# EasyEDA Pro project ecg_frontend.epro

# Schematic Copy of Sheet1
Board Name: Copy of Sheet1; Create Date: 2025-10-21; Page Name: Copy of Sheet1; Project Name: ecg_frontend; Schematic Name: Copy of Sheet1; Update Date: 2025-10-22; Address1: *; Address2: *; Address3: *; Address4: *; Application_BuildNumber: *; ApprovedBy: *; Author: *; CheckedBy: *; CompanyName: *; CurrentDate: *; CurrentTime: *; Date: *; DocumentFullPathAndName: *; DocumentName: *; DocumentNumber: *; DrawnBy: *; Engineer: *; ImagePath: *; ModifiedDate: *; Organization: *; ProjectName: *; Revision: *; Rule: *; SheetNumber: 1; SheetTotal: 1; Time: *; Title: *
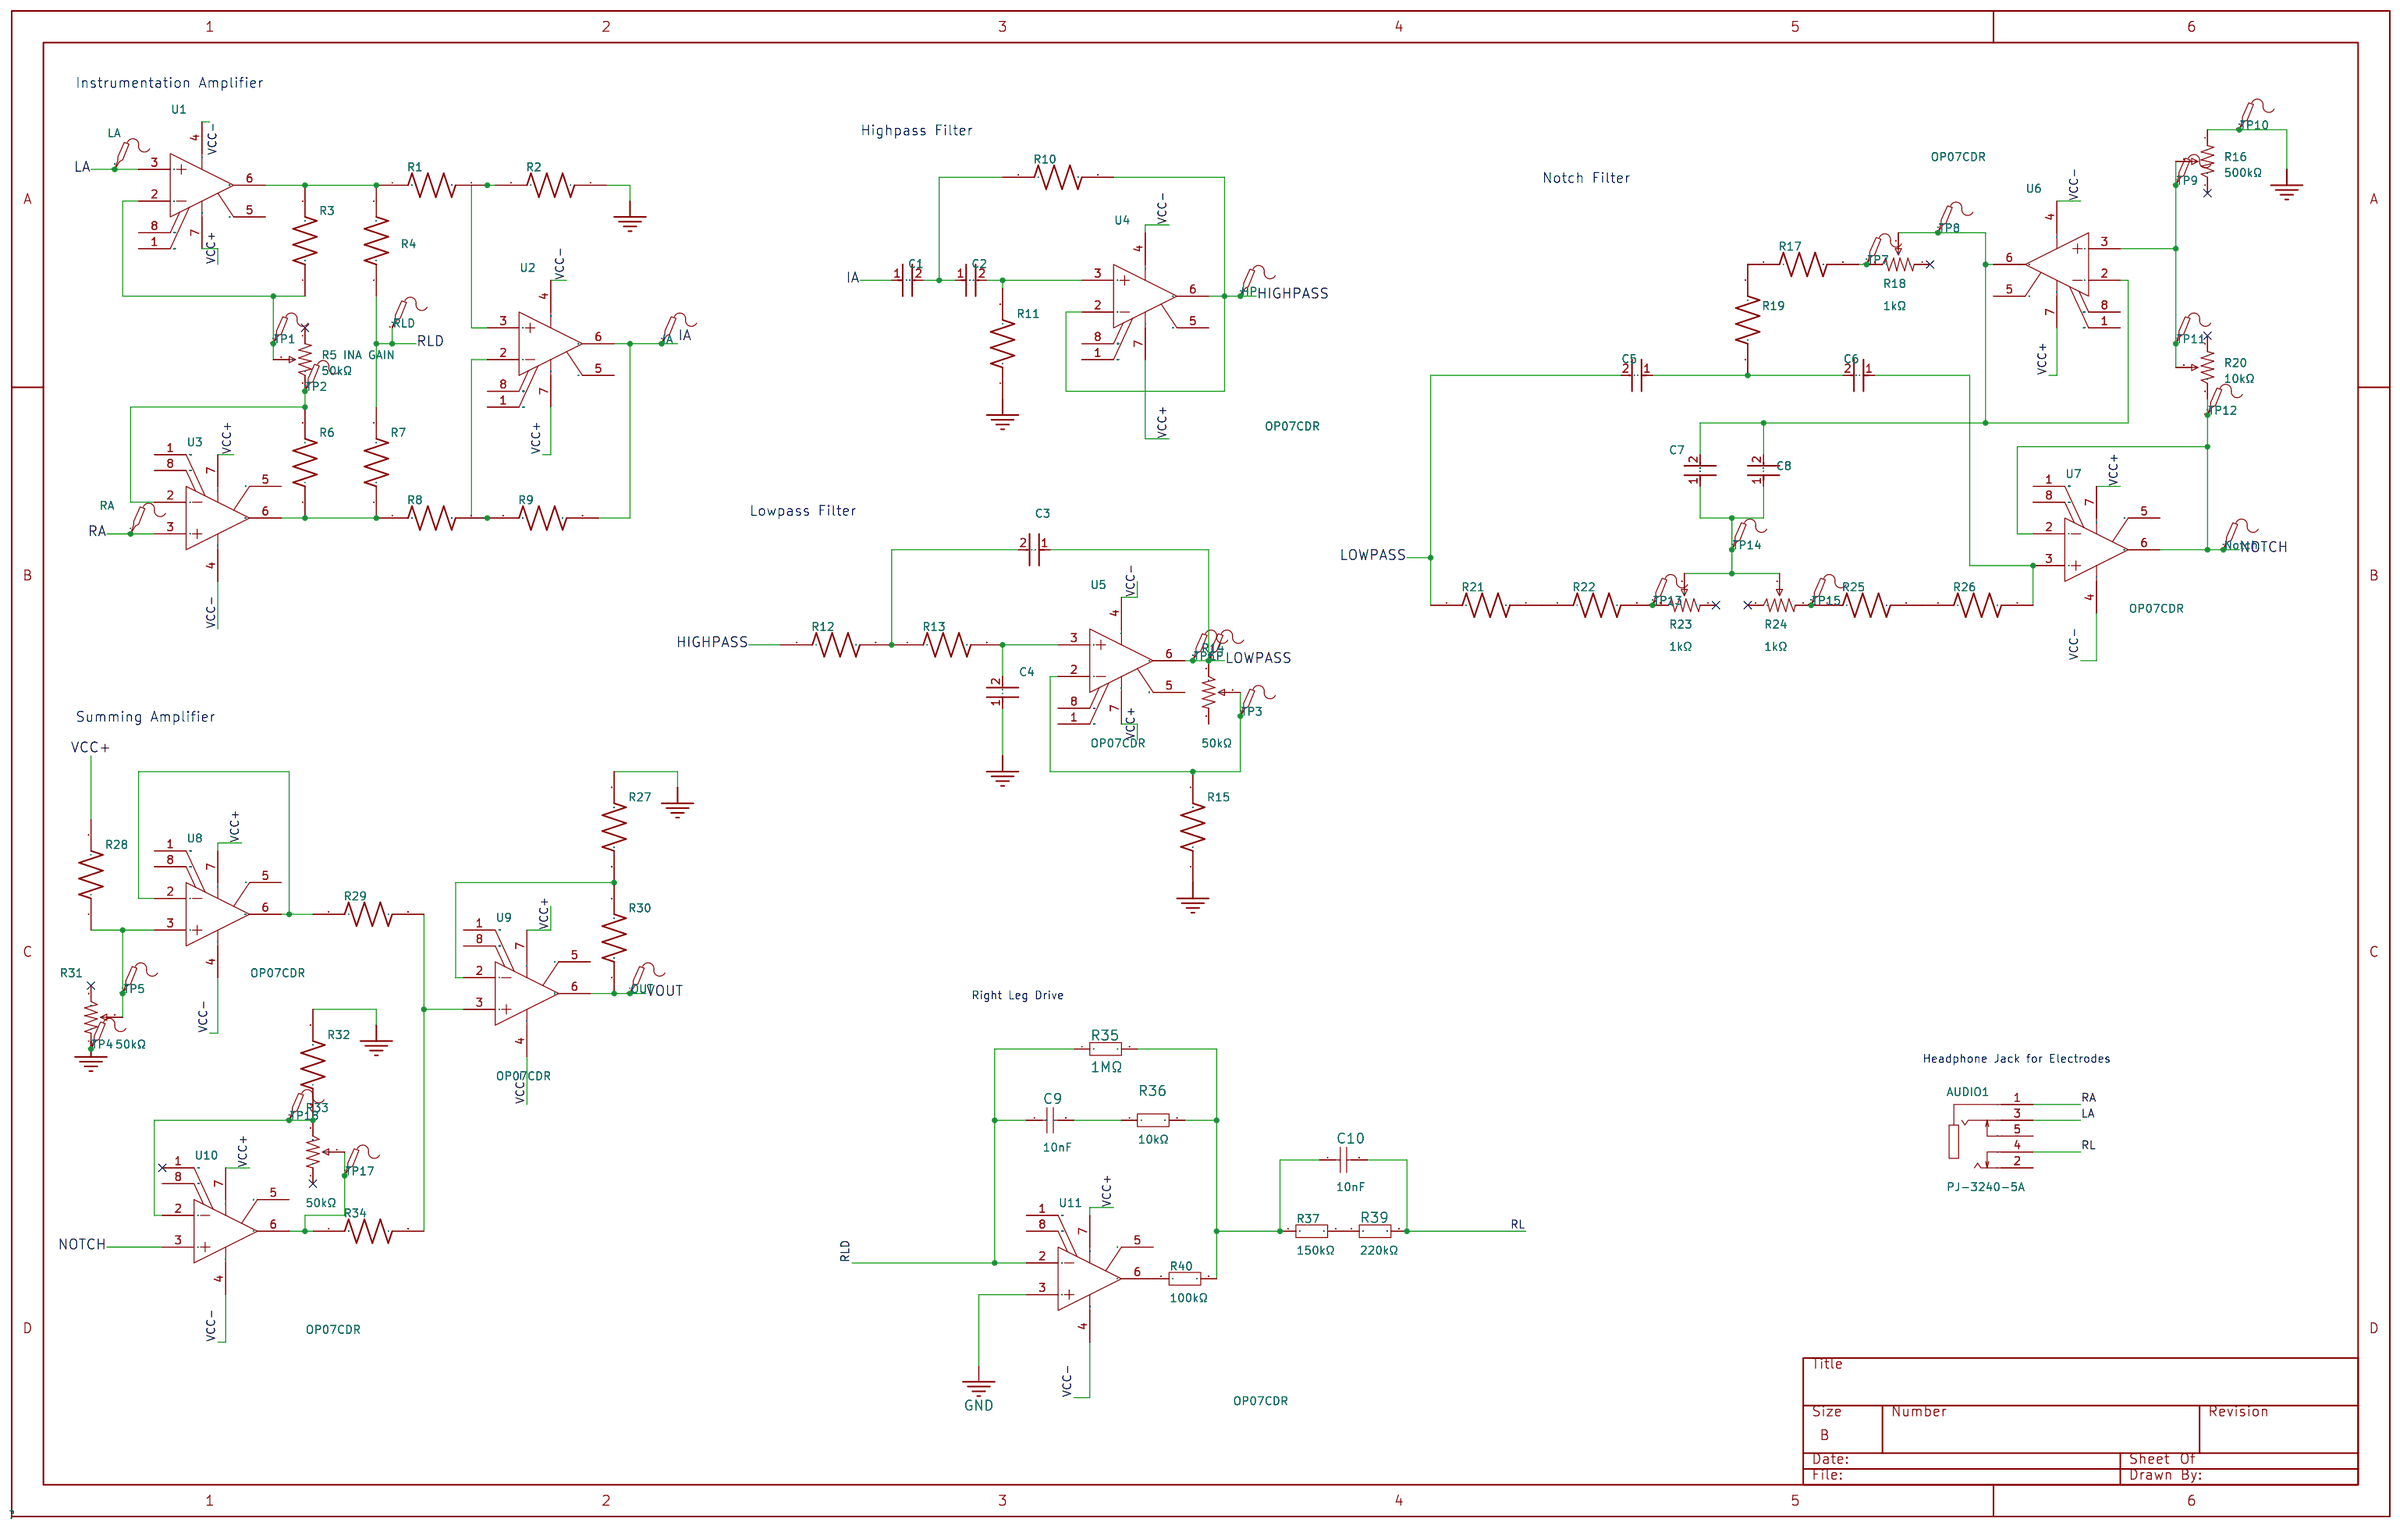
[diagram p0: schematic sheet]

## Parts
AUDIO1  PJ-3240-5A  [AUDIO-TH_PJ-3240-5A]
C1  100uF  [C1206]
C2  100uF  [C1206]
C3  100nF  [C0402]
C4  100nF  [C0402]
C5  100nF  [C0402]
C6  100nF  [C0402]
C7  100nF  [C0402]
C8  100nF  [C0402]
C9  10nF  [C0603]
C10  10nF  [C0603]
HP  -  [Test-Point-0.5mm]
IA  -  [Test-Point-0.5mm]
LA  -  [Test-Point-0.5mm]
LP  -  [Test-Point-0.5mm]
Notch  -  [Test-Point-0.5mm]
OUT  -  [Test-Point-0.5mm]
R1  10kΩ  [R0603]
R2  49.9kΩ  [R0603]
R3  100kΩ  [R0603]
R4  100kΩ  [R0603]
R5 INA GAIN  50kΩ  [RES-ADJ-TH_3P-L9.5-W4.85-P2.50-BL-BS]
R6  100kΩ  [R0603]
R7  100kΩ  [R0603]
R8  10kΩ  [R0603]
R9  49.9kΩ  [R0603]
R10  15kΩ  [R0603]
R11  33kΩ  [R0603]
R12  10kΩ  [R0603]
R13  10kΩ  [R0603]
R14  50kΩ  [RES-ADJ-TH_3P-L9.5-W4.85-P2.50-BL-BS]
R15  10kΩ  [R0603]
R16  500kΩ  [RES-ADJ-TH_3P-L9.5-W4.85-P2.50-BL-BS]
R17  680Ω  [R0603]
R18  1kΩ  [RES-ADJ-TH_3296W-1-203]
R19  15kΩ  [R0603]
R20  10kΩ  [RES-ADJ-TH_3296W]
R21  30kΩ  [R0603]
R22  1.5kΩ  [R0603]
R23  1kΩ  [RES-ADJ-TH_3296W-1-203]
R24  1kΩ  [RES-ADJ-TH_3296W-1-203]
R25  30kΩ  [R0603]
R26  1.5kΩ  [R0603]
R27  10kΩ  [R0603]
R28  10kΩ  [R0603]
R29  10kΩ  [R0603]
R30  10kΩ  [R0603]
R31  50kΩ  [RES-ADJ-TH_3P-L9.5-W4.85-P2.50-BL-BS]
R32  10kΩ  [R0603]
R33  50kΩ  [RES-ADJ-TH_3P-L9.5-W4.85-P2.50-BL-BS]
R34  10kΩ  [R0603]
R35  1MΩ  [R0603]
R36  10kΩ  [R0603]
R37  150kΩ  [R0603]
R39  220kΩ  [R0603]
R40  100kΩ  [R0603]
RA  -  [Test-Point-0.5mm]
RLD  -  [Test-Point-0.5mm]
TP1  -  [Test-Point-0.5mm]
TP2  -  [Test-Point-0.5mm]
TP3  -  [Test-Point-0.5mm]
TP4  -  [Test-Point-0.5mm]
TP5  -  [Test-Point-0.5mm]
TP6  -  [Test-Point-0.5mm]
TP7  -  [Test-Point-0.5mm]
TP8  -  [Test-Point-0.5mm]
TP9  -  [Test-Point-0.5mm]
TP10  -  [Test-Point-0.5mm]
TP11  -  [Test-Point-0.5mm]
TP12  -  [Test-Point-0.5mm]
TP13  -  [Test-Point-0.5mm]
TP14  -  [Test-Point-0.5mm]
TP15  -  [Test-Point-0.5mm]
TP17  -  [Test-Point-0.5mm]
TP18  -  [Test-Point-0.5mm]
U1  OP07CDR  [SOIC-8_L4.9-W3.9-P1.27-LS6.0-BL]
U2  OP07CDR  [SOIC-8_L4.9-W3.9-P1.27-LS6.0-BL]
U3  OP07CDR  [SOIC-8_L4.9-W3.9-P1.27-LS6.0-BL]
U4  OP07CDR  [SOIC-8_L4.9-W3.9-P1.27-LS6.0-BL]
U5  OP07CDR  [SOIC-8_L4.9-W3.9-P1.27-LS6.0-BL]
U6  OP07CDR  [SOIC-8_L4.9-W3.9-P1.27-LS6.0-BL]
U7  OP07CDR  [SOIC-8_L4.9-W3.9-P1.27-LS6.0-BL]
U8  OP07CDR  [SOIC-8_L4.9-W3.9-P1.27-LS6.0-BL]
U9  OP07CDR  [SOIC-8_L4.9-W3.9-P1.27-LS6.0-BL]
U10  OP07CDR  [SOIC-8_L4.9-W3.9-P1.27-LS6.0-BL]
U11  OP07CDR  [SOIC-8_L4.9-W3.9-P1.27-LS6.0-BL]

## Library data of the parts
AUDIO1 = PJ-3240-5A: Connector Type:3.5mm Headphone Jack Current Rating:500mA Voltage Rating (Max):30V; LCSC Part Name: 3.5mm耳机座; Supplier Part: C145814; Manufacturer: 韩国韩荣; Supplier Footprint: 插件; JLCPCB Part Class: Extended Part; Datasheet: https://item.szlcsc.com/datasheet/PJ-3240-5A/157146.html; Supplier: LCSC; Connector Type: 3.5mm Headphone Jack; Current Rating: 500mA; Voltage Rating (Max): 30V
C1 C2 = CL31A107MQHNNNE: Capacitance:100uF Tolerance:±20% Tolerance:±20% Voltage Rating:6.3V Temperature Coefficient:X5R; LCSC Part Name: 100uF ±20% 6.3V; Supplier Part: C15008; Manufacturer: SAMSUNG(三星); Supplier Footprint: 1206; JLCPCB Part Class: Basic Part; Datasheet: https://item.szlcsc.com/datasheet/CL31A107MQHNNNE/15681.html; Supplier: LCSC; Tolerance: ±20%; Voltage Rating: 6.3V; Temperature Coefficient: X5R
C3-C8 = CL05B104KO5NNNC: Capacitance:100nF Tolerance:±10% Tolerance:±10% Voltage Rating:16V Temperature Coefficient:X7R; LCSC Part Name: 100nF ±10% 16V; Supplier Part: C1525; Manufacturer: SAMSUNG(三星); Supplier Footprint: 0402; JLCPCB Part Class: Basic Part; Datasheet: https://item.szlcsc.com/datasheet/CL05B104KO5NNNC/1877.html; Supplier: LCSC; Tolerance: ±10%; Voltage Rating: 16V; Temperature Coefficient: X7R
C9 C10 = 0603B103K500NT: Capacitance:10nF Tolerance:±10% Tolerance:±10% Voltage Rating:50V Temperature Coefficient:X7R; LCSC Part Name: 10nF ±10% 50V; Supplier Part: C57112; Manufacturer: FH(风华); Supplier Footprint: 0603; JLCPCB Part Class: Basic Part; Datasheet: https://item.szlcsc.com/datasheet/0603B103K500NT/58143.html; Supplier: LCSC; Tolerance: ±10%; Voltage Rating: 50V; Temperature Coefficient: X7R
HP IA LA LP Notch OUT RA RLD TP1-TP15 TP17 TP18 = Test-Point: Test Point 测试点
R1 R8 R12 R13 R15 R27-R30 R32 R34 R36 = 0603WAF1002T5E: Type:Thick Film Resistor Resistance:10kΩ Tolerance:±1% Tolerance:±1% Power(Watts):100mW Voltage-Supply(Max):75V Temperature Coefficient:±100ppm/℃ Temperature Coefficient:±100ppm/℃ Operating Temperature:-55℃~+155℃ Operating Temperature:-55℃~+155℃; LCSC Part Name: 厚膜电阻 10kΩ ±1% 100mW; Supplier Part: C25804; Manufacturer: UNI-ROYAL(厚声); Supplier Footprint: 0603; JLCPCB Part Class: Basic Part; Datasheet: https://item.szlcsc.com/datasheet/0603WAF1002T5E/26547.html; Supplier: LCSC; Type: Thick Film Resistor; Tolerance: ±1%; Power(Watts): 100mW; Voltage-Supply(Max): 75V; Temperature Coefficient: ±100ppm/℃; Operating Temperature: -55℃~+155℃
R2 R9 = 0603WAF4992T5E: Type:Thick Film Resistor Resistance:49.9kΩ Tolerance:±1% Tolerance:±1% Power(Watts):100mW Voltage-Supply(Max):75V Temperature Coefficient:±100ppm/℃ Temperature Coefficient:±100ppm/℃ Operating Temperature:-55℃~+155℃ Operating Temperature:-55℃~+155℃; LCSC Part Name: 49.9kΩ ±1% 100mW 厚膜电阻; Supplier Part: C23184; Manufacturer: UNI-ROYAL(厚声); Supplier Footprint: 0603; JLCPCB Part Class: Basic Part; Datasheet: https://item.szlcsc.com/datasheet/0603WAF4992T5E/23911.html; Supplier: LCSC; Type: Thick Film Resistor; Tolerance: ±1%; Power(Watts): 100mW; Voltage-Supply(Max): 75V; Temperature Coefficient: ±100ppm/℃; Operating Temperature: -55℃~+155℃
R3 R4 R6 R7 R40 = 0603WAF1003T5E: Type:Thick Film Resistor Resistance:100kΩ Tolerance:±1% Tolerance:±1% Power(Watts):100mW Voltage-Supply(Max):75V Temperature Coefficient:±100ppm/℃ Temperature Coefficient:±100ppm/℃ Operating Temperature:-55℃~+155℃ Operating Temperature:-55℃~+155℃; LCSC Part Name: 100kΩ ±1% 100mW 厚膜电阻; Supplier Part: C25803; Manufacturer: UNI-ROYAL(厚声); Supplier Footprint: 0603; JLCPCB Part Class: Basic Part; Datasheet: https://item.szlcsc.com/datasheet/0603WAF1003T5E/26546.html; Supplier: LCSC; Type: Thick Film Resistor; Tolerance: ±1%; Power(Watts): 100mW; Voltage-Supply(Max): 75V; Temperature Coefficient: ±100ppm/℃; Operating Temperature: -55℃~+155℃
R5 INA GAIN R14 R31 R33 = 3296W-1-503_C48997928: Resistance:50kΩ Tolerance:±10% Tolerance:±10% Power(Watts):500mW Temperature Coefficient:±250ppm/℃ Temperature Coefficient:±250ppm/℃ Number of Turns:28; LCSC Part Name: 3296W-1-503; Supplier Part: C48997928; Manufacturer: JIERR(捷而瑞); Manufacturer Part: 3296W-1-503; Supplier Footprint: 插件-3P,9.5x4.9mm; JLCPCB Part Class: Extended Part; Datasheet: https://item.szlcsc.com/datasheet/3296W-1-503/51342064.html; Supplier: LCSC; Tolerance: ±10%; Power(Watts): 500mW; Temperature Coefficient: ±250ppm/℃; Number of Turns: 28
R10 R19 = 0603WAF1502T5E: Type:Thick Film Resistor Resistance:15kΩ Tolerance:±1% Tolerance:±1% Power(Watts):100mW Voltage-Supply(Max):75V Temperature Coefficient:±100ppm/℃ Temperature Coefficient:±100ppm/℃ Operating Temperature:-55℃~+155℃ Operating Temperature:-55℃~+155℃; LCSC Part Name: 15kΩ ±1% 100mW 厚膜电阻; Supplier Part: C22809; Manufacturer: UNI-ROYAL(厚声); Supplier Footprint: 0603; JLCPCB Part Class: Basic Part; Datasheet: https://item.szlcsc.com/datasheet/0603WAF1502T5E/23536.html; Supplier: LCSC; Type: Thick Film Resistor; Tolerance: ±1%; Power(Watts): 100mW; Voltage-Supply(Max): 75V; Temperature Coefficient: ±100ppm/℃; Operating Temperature: -55℃~+155℃
R11 = 0603WAF3302T5E: Type:Thick Film Resistor Resistance:33kΩ Tolerance:±1% Tolerance:±1% Power(Watts):100mW Voltage-Supply(Max):75V Temperature Coefficient:±100ppm/℃ Temperature Coefficient:±100ppm/℃ Operating Temperature:-55℃~+155℃ Operating Temperature:-55℃~+155℃; LCSC Part Name: 33kΩ ±1% 100mW 厚膜电阻; Supplier Part: C4216; Manufacturer: UNI-ROYAL(厚声); Supplier Footprint: 0603; JLCPCB Part Class: Basic Part; Datasheet: https://item.szlcsc.com/datasheet/0603WAF3302T5E/4623.html; Supplier: LCSC; Type: Thick Film Resistor; Tolerance: ±1%; Power(Watts): 100mW; Voltage-Supply(Max): 75V; Temperature Coefficient: ±100ppm/℃; Operating Temperature: -55℃~+155℃
R16 = 3296W-1-504_C48997927: Resistance:500kΩ Tolerance:±10% Tolerance:±10% Power(Watts):500mW Temperature Coefficient:±250ppm/℃ Temperature Coefficient:±250ppm/℃ Number of Turns:28; LCSC Part Name: 3296W-1-504; Supplier Part: C48997927; Manufacturer: JIERR(捷而瑞); Manufacturer Part: 3296W-1-504; Supplier Footprint: 插件-3P,9.5x4.9mm; JLCPCB Part Class: Extended Part; Datasheet: https://item.szlcsc.com/datasheet/3296W-1-504/51342063.html; Supplier: LCSC; Tolerance: ±10%; Power(Watts): 500mW; Temperature Coefficient: ±250ppm/℃; Number of Turns: 28
R17 = 0603WAF6800T5E: Type:Thick Film Resistors Resistance: Tolerance:±1% Tolerance:±1% Power(Watts): Overload Voltage (Max): Temperature Coefficient:±100ppm/℃ Temperature Coefficient:±100ppm/℃ Operating Temperature Range:-55℃~+155℃ Operating Temperature Range:-55℃~+155℃; LCSC Part Name: 680Ω ±1% 100mW 厚膜电阻; Supplier Part: C23228; Manufacturer: UNI-ROYAL(厚声); Supplier Footprint: 0603; JLCPCB Part Class: Basic Part; Datasheet: https://atta.szlcsc.com/upload/public/pdf/source/20200306/C422600_1E6D84923E4A46A82E41ADD87F860B5C.pdf; Supplier: LCSC; Type: Thick Film Resistors; Tolerance: ±1%; Temperature Coefficient: ±100ppm/℃; Operating Temperature Range: -55℃~+155℃
R18 R23 R24 = 3296W-1-102_C48997938: Resistance:1kΩ Tolerance:±10% Tolerance:±10% Power(Watts):500mW Temperature Coefficient:±250ppm/℃ Temperature Coefficient:±250ppm/℃ Number of Turns:28; LCSC Part Name: 3296W-1-102; Supplier Part: C48997938; Manufacturer: JIERR(捷而瑞); Manufacturer Part: 3296W-1-102; Supplier Footprint: 插件-3P,9.5x4.9mm; JLCPCB Part Class: Extended Part; Datasheet: https://item.szlcsc.com/datasheet/3296W-1-102/51342074.html; Supplier: LCSC; Tolerance: ±10%; Power(Watts): 500mW; Temperature Coefficient: ±250ppm/℃; Number of Turns: 28
R20 = 3296W-1-103_C48997937: Resistance:10kΩ Tolerance:±10% Tolerance:±10% Power(Watts):500mW Temperature Coefficient:±250ppm/℃ Temperature Coefficient:±250ppm/℃ Number of Turns:28; LCSC Part Name: 3296W-1-103; Supplier Part: C48997937; Manufacturer: JIERR(捷而瑞); Manufacturer Part: 3296W-1-103; Supplier Footprint: 插件-3P,9.5x4.9mm; JLCPCB Part Class: Extended Part; Datasheet: https://item.szlcsc.com/datasheet/3296W-1-103/51342073.html; Supplier: LCSC; Tolerance: ±10%; Power(Watts): 500mW; Temperature Coefficient: ±250ppm/℃; Number of Turns: 28
R21 R25 = 0603WAF3002T5E: Type:Thick Film Resistor Resistance:30kΩ Tolerance:±1% Tolerance:±1% Power(Watts):100mW Voltage-Supply(Max):75V Temperature Coefficient:±100ppm/℃ Temperature Coefficient:±100ppm/℃ Operating Temperature:-55℃~+155℃ Operating Temperature:-55℃~+155℃; LCSC Part Name: 30kΩ ±1% 100mW 厚膜电阻; Supplier Part: C22984; Manufacturer: UNI-ROYAL(厚声); Supplier Footprint: 0603; JLCPCB Part Class: Basic Part; Datasheet: https://item.szlcsc.com/datasheet/0603WAF3002T5E/23711.html; Supplier: LCSC; Type: Thick Film Resistor; Tolerance: ±1%; Power(Watts): 100mW; Voltage-Supply(Max): 75V; Temperature Coefficient: ±100ppm/℃; Operating Temperature: -55℃~+155℃
R22 R26 = 0603WAF1501T5E: Type:Thick Film Resistor Resistance:1.5kΩ Tolerance:±1% Tolerance:±1% Power(Watts):100mW Voltage-Supply(Max):75V Temperature Coefficient:±100ppm/℃ Temperature Coefficient:±100ppm/℃ Operating Temperature:-55℃~+155℃ Operating Temperature:-55℃~+155℃; LCSC Part Name: 1.5kΩ ±1% 100mW 厚膜电阻; Supplier Part: C22843; Manufacturer: UNI-ROYAL(厚声); Supplier Footprint: 0603; JLCPCB Part Class: Basic Part; Datasheet: https://item.szlcsc.com/datasheet/0603WAF1501T5E/23570.html; Supplier: LCSC; Type: Thick Film Resistor; Tolerance: ±1%; Power(Watts): 100mW; Voltage-Supply(Max): 75V; Temperature Coefficient: ±100ppm/℃; Operating Temperature: -55℃~+155℃
R35 = 0603WAF1004T5E: Type:Thick Film Resistors Resistance:1MΩ Tolerance:±1% Tolerance:±1% Power(Watts): Overload Voltage (Max): Temperature Coefficient:±100ppm/℃ Temperature Coefficient:±100ppm/℃ Operating Temperature Range:-55℃~+155℃ Operating Temperature Range:-55℃~+155℃; LCSC Part Name: 1MΩ ±1% 100mW 厚膜电阻; Supplier Part: C22935; Manufacturer: UNI-ROYAL(厚声); Supplier Footprint: 0603; JLCPCB Part Class: Basic Part; Datasheet: https://atta.szlcsc.com/upload/public/pdf/source/20200306/C422600_1E6D84923E4A46A82E41ADD87F860B5C.pdf; Supplier: LCSC; Type: Thick Film Resistors; Tolerance: ±1%; Temperature Coefficient: ±100ppm/℃; Operating Temperature Range: -55℃~+155℃
R37 = 0603WAF1503T5E: Type:Thick Film Resistors Resistance:150kΩ Tolerance:±1% Tolerance:±1% Power(Watts):0.1W Voltage-Supply(Max):75V Temperature Coefficient:±100ppm/℃ Temperature Coefficient:±100ppm/℃ Operating Temperature:-55℃~+155℃ Operating Temperature:-55℃~+155℃; LCSC Part Name: 150kΩ ±1% 100mW 厚膜电阻; Supplier Part: C22807; Manufacturer: UNI-ROYAL(厚声); Supplier Footprint: 0603; JLCPCB Part Class: Basic Part; Datasheet: https://item.szlcsc.com/datasheet/0603WAF1503T5E/23534.html; Supplier: LCSC; Type: Thick Film Resistors; Tolerance: ±1%; Power(Watts): 0.1W; Voltage-Supply(Max): 75V; Temperature Coefficient: ±100ppm/℃; Operating Temperature: -55℃~+155℃
R39 = 0603WAF2203T5E: Type:Thick Film Resistor Resistance:220kΩ Tolerance:±1% Tolerance:±1% Power(Watts):100mW Voltage-Supply(Max):75V Temperature Coefficient:±100ppm/℃ Temperature Coefficient:±100ppm/℃ Operating Temperature:-55℃~+155℃ Operating Temperature:-55℃~+155℃; LCSC Part Name: 220kΩ ±1% 100mW 厚膜电阻; Supplier Part: C22961; Manufacturer: UNI-ROYAL(厚声); Supplier Footprint: 0603; JLCPCB Part Class: Basic Part; Datasheet: https://item.szlcsc.com/datasheet/0603WAF2203T5E/23688.html; Supplier: LCSC; Type: Thick Film Resistor; Tolerance: ±1%; Power(Watts): 100mW; Voltage-Supply(Max): 75V; Temperature Coefficient: ±100ppm/℃; Operating Temperature: -55℃~+155℃
U1-U11 = OP07CDR: Number of Channels:Single channel Gain Bandwidth Product:600kHz Ib - Input Bias Current:1.8nA Slew Rate:0.3V/us Output Type:- Rail to Rail:- Operating Temperature:0℃~+70℃ Operating Temperature:0℃~+70℃; LCSC Part Name: 精密运算放大器; Supplier Part: C7433; Manufacturer: TI(德州仪器); Supplier Footprint: SOIC-8; JLCPCB Part Class: Basic Part; Datasheet: http://www.ti.com/cn/lit/gpn/op07c; Supplier: LCSC; Number of Channels: Single channel; Gain Bandwidth Product: 600kHz; Ib - Input Bias Current: 1.8nA; Slew Rate: 0.3V/us; Operating Temperature: 0℃~+70℃

## Nets
GND: C4.1 R2.2 R11.1 R15.1 R16.1 R27.2 R31.1 R32.2 TP4.1 TP10.1 U11.3(IN+)
VCC+: R28.2 U1.7(VCC+) U2.7(VCC+) U3.7(VCC+) U4.7(VCC+) U5.7(VCC+) U6.7(VCC+) U7.7(VCC+) U8.7(VCC+) U9.7(VCC+) U10.7(VCC+) U11.7(VCC+)
VCC-: U1.4(VCC-) U2.4(VCC-) U3.4(VCC-) U4.4(VCC-) U5.4(VCC-) U6.4(VCC-) U7.4(VCC-) U8.4(VCC-) U9.4(VCC-) U10.4(VCC-) U11.4(VCC-)
HIGHPASS: HP.1 R10.2 R12.1 U4.2(IN-) U4.6(OUT)
IA: C1.1 IA.1 R9.2 U2.6(OUT)
LA: AUDIO1.3 LA.1 U1.3(IN+)
LOWPASS: C3.1 C5.2 LP.1 R14.3 R21.1 TP6.1 U5.6(OUT)
NOTCH: Notch.1 R20.3 TP12.1 U7.2(IN-) U7.6(OUT) U10.3(IN+)
RA: AUDIO1.1 RA.1 U3.3(IN+)
RL: AUDIO1.4 C10.2 R39.2
RLD: C9.1 R4.1 R7.2 R35.1 RLD.1 U11.2(IN-)
VOUT: OUT.1 R30.1 U9.6(OUT)
Net-(C1-2): C1.2 C2.1 R10.1
Net-(C2-2): C2.2 R11.2 U4.3(IN+)
Net-(C3-2): C3.2 R12.2 R13.1
Net-(C4-2): C4.2 R13.2 U5.3(IN+)
Net-(C5-1): C5.1 C6.2 R19.1
Net-(C6-1): C6.1 R26.2 U7.3(IN+)
Net-(C7-1): C7.1 C8.1 R23.2 R24.2 TP14.1
Net-(C7-2): C7.2 C8.2 R18.2 TP8.1 U6.2(IN-) U6.6(OUT)
Net-(C9-2): C9.2 R36.1
Net-(C10-1): C10.1 R35.2 R36.2 R37.1 R40.2
Net-(R1-1): R1.1 R3.2 R4.2 U1.6(OUT)
Net-(R1-2): R1.2 R2.1 U2.3(IN+)
Net-(R3-1): R3.1 R5 INA GAIN.2 TP1.1 U1.2(IN-)
Net-(R5 INA GAIN-3): R5 INA GAIN.3 R6.2 TP2.1 U3.2(IN-)
Net-(R6-1): R6.1 R7.1 R8.1 U3.6(OUT)
Net-(R8-2): R8.2 R9.1 U2.2(IN-)
Net-(R14-2): R14.2 R15.2 TP3.1 U5.2(IN-)
Net-(R16-2): R16.2 R20.2 TP9.1 TP11.1 U6.3(IN+)
Net-(R17-1): R17.1 R19.2
Net-(R17-2): R17.2 R18.3 TP7.1
Net-(R21-2): R21.2 R22.1
Net-(R22-2): R22.2 R23.3 TP13.1
Net-(R24-1): R24.1 R25.1 TP15.1
Net-(R25-2): R25.2 R26.1
Net-(R27-1): R27.1 R30.2 U9.2(IN-)
Net-(R28-1): R28.1 R31.2 TP5.1 U8.3(IN+)
Net-(R29-1): R29.1 R34.1 U9.3(IN+)
Net-(R29-2): R29.2 U8.2(IN-) U8.6(OUT)
Net-(R32-1): R32.1 R33.3 TP18.1 U10.2(IN-)
Net-(R33-2): R33.2 R34.2 TP17.1 U10.6(OUT)
Net-(R37-2): R37.2 R39.1
Net-(R40-1): R40.1 U11.6(OUT)

Not connected (* = marked no-connect by the designer): AUDIO1 2 5; R5 INA GAIN 1*; R14 1; R16 3*; R18 1*; R20 1*; R23 1*; R24 3*; R31 3*; R33 1*; U1 1(OFFSET N1) 5(NC) 8(OFFSET N2); U2 1(OFFSET N1) 5(NC) 8(OFFSET N2); U3 1(OFFSET N1) 5(NC) 8(OFFSET N2); U4 1(OFFSET N1) 5(NC) 8(OFFSET N2); U5 1(OFFSET N1) 5(NC) 8(OFFSET N2); U6 1(OFFSET N1) 5(NC) 8(OFFSET N2); U7 1(OFFSET N1) 5(NC) 8(OFFSET N2); U8 1(OFFSET N1) 5(NC) 8(OFFSET N2); U9 1(OFFSET N1) 5(NC) 8(OFFSET N2); U10 1(OFFSET N1)* 5(NC) 8(OFFSET N2); U11 1(OFFSET N1) 5(NC) 8(OFFSET N2)

## Notes on the sheet
- Instrumentation Amplifier
- Highpass Filter
- Notch Filter
- Lowpass Filter
- Summing Amplifier
- Right Leg Drive
- Headphone Jack for Electrodes
